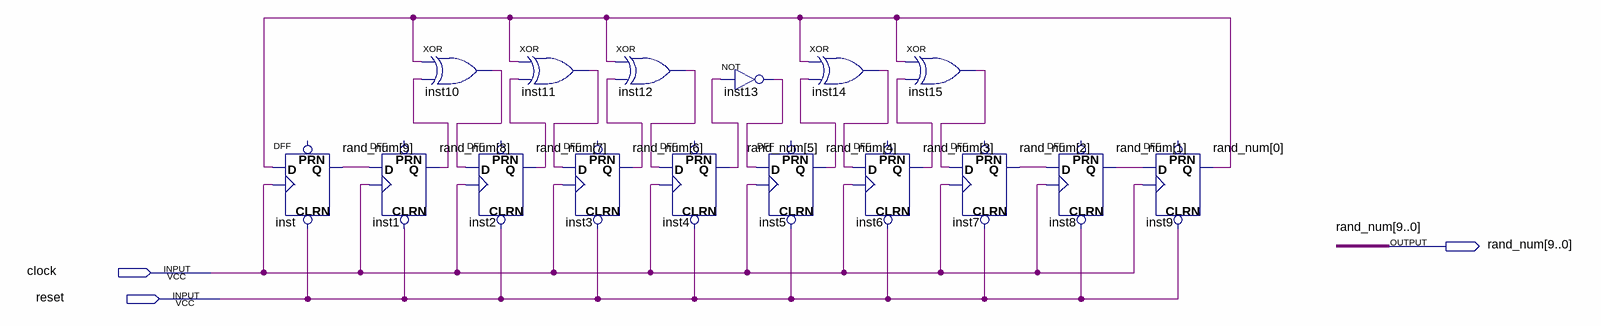
[diagram p0: schematic sheet]
// Quartus schematic rand_gen.bdf as structural Verilog: 16 symbols, 3 pins
module rand_gen (
  input  clock,
  input  reset,
  output [9:0] rand_num
);

  wire inst4_q, inst10_out, inst11_out, inst12_out, inst14_out, inst15_out;

  DFF inst (.CLRN(reset), .CLK(clock), .D(rand_num[0]), .Q(rand_num[9]));  // open: PRN
  DFF inst1 (.CLRN(reset), .CLK(clock), .D(rand_num[9]), .Q(rand_num[8]));  // open: PRN
  xor inst10 (inst10_out, rand_num[0], rand_num[8]);
  DFF inst2 (.CLRN(reset), .CLK(clock), .D(inst10_out), .Q(rand_num[7]));  // open: PRN
  xor inst11 (inst11_out, rand_num[0], rand_num[7]);
  DFF inst3 (.CLRN(reset), .CLK(clock), .D(inst11_out), .Q(rand_num[6]));  // open: PRN
  xor inst12 (inst12_out, rand_num[0], rand_num[6]);
  not inst13 (rand_num[5], inst4_q);
  DFF inst4 (.CLRN(reset), .CLK(clock), .D(inst12_out), .Q(inst4_q));  // open: PRN
  DFF inst5 (.CLRN(reset), .CLK(clock), .D(rand_num[5]), .Q(rand_num[4]));  // open: PRN
  xor inst14 (inst14_out, rand_num[0], rand_num[4]);
  DFF inst6 (.CLRN(reset), .CLK(clock), .D(inst14_out), .Q(rand_num[3]));  // open: PRN
  xor inst15 (inst15_out, rand_num[0], rand_num[3]);
  DFF inst7 (.CLRN(reset), .CLK(clock), .D(inst15_out), .Q(rand_num[2]));  // open: PRN
  DFF inst8 (.CLRN(reset), .CLK(clock), .D(rand_num[2]), .Q(rand_num[1]));  // open: PRN
  DFF inst9 (.CLRN(reset), .CLK(clock), .D(rand_num[1]), .Q(rand_num[0]));  // open: PRN
endmodule
